# Altium schematic sheet ANALOG_OUTPUT.SchDoc: Analog output
size A4; Author: eldar6776@hotmail.com; DrawnBy: Eldar Dedic; Organization: PROVEN d.o.o.; Address1: Adema Buće 102; Address2: 71000 Sarajevo; Address3: Federacija BiH; Address4: Bosna i Hercegovina; DocumentNumber: CD-26514; Revision: 001; SheetNumber: 2; SheetTotal: 8; ProjectName: KONTROLER TRANSPORTA MATERIJALA
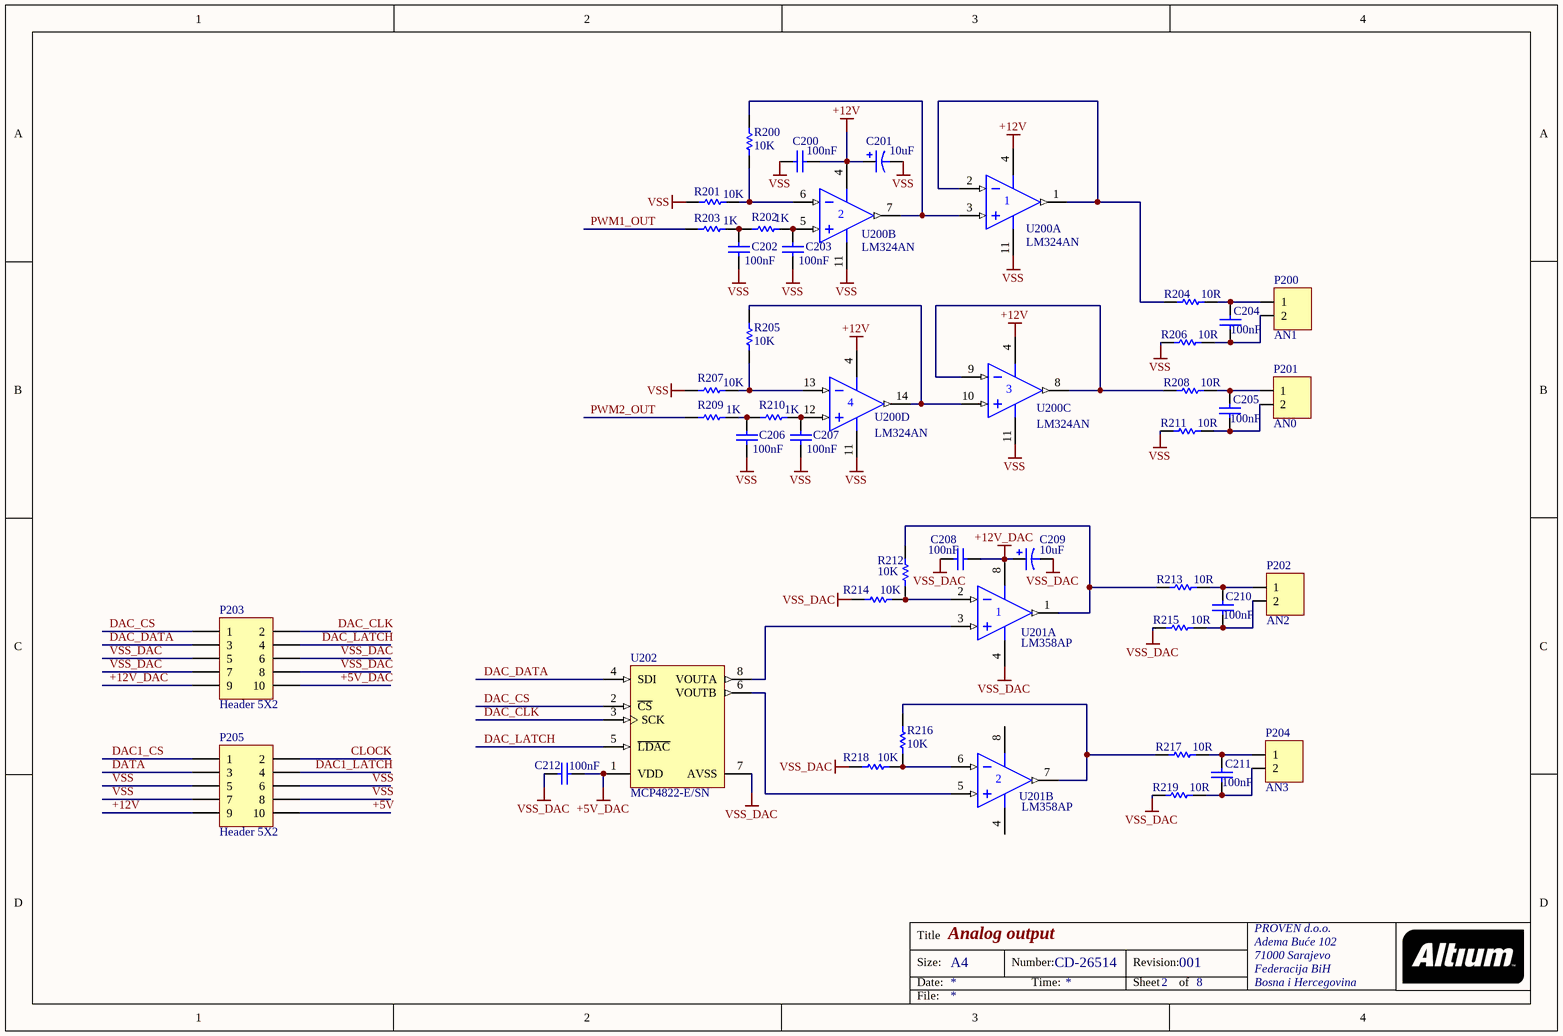
[diagram p0: ANALOG_OUTPUT.SchDoc]

## Parts
C200  value 100nF  [1206]
C201  10uF  [E]
C202  value 100nF  [1206]
C203  value 100nF  [1206]
C204  value 100nF  [1206]
C205  value 100nF  [1206]
C206  value 100nF  [1206]
C207  value 100nF  [1206]
C208  value 100nF  [1206]
C209  10uF  [CAPPR2.5-6.3X7]
C210  value 100nF  [1206]
C211  value 100nF  [1206]
C212  value 100nF  [1206]
P200  AN1  [TERMINAL BLOK 2]
P201  AN0  [TERMINAL BLOK 2]
P202  AN2  [TERMINAL BLOK 2]
P203  Header 5X2  [HDR2X5]
P204  AN3  [TERMINAL BLOK 2]
P205  Header 5X2  [HDR2X5]
R200  10K  [ERA-0805]
R201  10K  [ERA-0805]
R202  1K  [ERA-0805]
R203  1K  [ERA-0805]
R204  10R  [ERA-0805]
R205  10K  [ERA-0805]
R206  10R  [ERA-0805]
R207  10K  [ERA-0805]
R208  10R  [ERA-0805]
R209  1K  [ERA-0805]
R210  1K  [ERA-0805]
R211  10R  [ERA-0805]
R212  10K  [ERA-0805]
R213  10R  [ERA-0805]
R214  10K  [ERA-0805]
R215  10R  [ERA-0805]
R216  10K  [ERA-0805]
R217  10R  [ERA-0805]
R218  10K  [ERA-0805]
R219  10R  [ERA-0805]
U200  LM324AN  [N014]  (parts A,B,C,D of 4)
U201  LM358AP  [P008]  (parts A,B of 2)
U202  MCP4822-E/SN  [PDIP300-P8]

## Nets
+5V_DAC: C212.2 P203.10 U202.1(VDD)
+12V: C200.2 C201.1 P205.9 U200.4(V+)
+12V_DAC: C208.2 C209.1 P203.9 U201.8(V+)
VSS: C200.1 C201.2 C202.1 C203.1 C206.1 C207.1 P205.5 P205.6 P205.7 P205.8 R201.1 R206.1 R207.1 R211.1 U200.11(V-)
VSS_DAC: C208.1 C209.2 C212.1 P203.5 P203.6 P203.7 P203.8 R214.2 R215.1 R218.2 R219.1 U201.4(V-) U202.7(AVSS)
+5V: P205.10
CLOCK: P205.2
DAC1_CS: P205.1
DAC1_LATCH: P205.4
DAC_CLK: P203.2 U202.3(SCK)
DAC_CS: P203.1 U202.2(~{CS})
DAC_DATA: P203.3 U202.4(SDI)
DAC_LATCH: P203.4 U202.5(~{LDAC})
DATA: P205.3
PWM1_OUT: R203.1
PWM2_OUT: R209.1
NetC202_2: C202.2 R202.1 R203.2
NetC203_2: C203.2 R202.2 U200.5(IN+)
NetC204_1: C204.1 P200.2 R206.2
NetC204_2: C204.2 P200.1 R204.2
NetC205_1: C205.1 P201.2 R211.2
NetC205_2: C205.2 P201.1 R208.2
NetC206_2: C206.2 R209.2 R210.1
NetC207_2: C207.2 R210.2 U200.12(IN+)
NetC210_1: C210.1 P202.2 R215.2
NetC210_2: C210.2 P202.1 R213.2
NetC211_1: C211.1 P204.2 R219.2
NetC211_2: C211.2 P204.1 R217.2
NetR200_1: R200.1 R201.2 U200.6(IN-)
NetR200_2: R200.2 U200.3(IN+) U200.7(OUT)
NetR204_1: R204.1 U200.1(OUT) U200.2(IN-)
NetR205_1: R205.1 R207.2 U200.13(IN-)
NetR205_2: R205.2 U200.10(IN+) U200.14(OUT)
NetR208_1: R208.1 U200.8(OUT) U200.9(IN-)
NetR212_1: R212.1 R214.1 U201.2(IN-)
NetR212_2: R212.2 R213.1 U201.1(OUT)
NetR216_1: R216.1 R218.1 U201.6(IN-)
NetR216_2: R216.2 R217.1 U201.7(OUT)
NetU201_3: U201.3(IN+) U202.8(VOUTA)
NetU201_5: U201.5(IN+) U202.6(VOUTB)

## Notes on the sheet
- Title
- Size:
- Date:
- A4
- Number:
- Time:
- Revision:
- Sheet
- of
- File:

## Library data of the parts
C200 C202-C208 C210-C212 = C1206: Ceramic Chip Capacitor - Standard; Published: 17-Jul-2002; LatestRevisionDate: 19-Mar-2004; LatestRevisionNote: Silkscreen size reduced.; DatasheetDocument: Mar-2001; PackageDocument: Mar-2001; PackageReference: 1206; Publisher: Altium Limited; Code_JEITA: 1206; Code_IPC: 3216 [1206]; ComponentLink1Description: Manufacturer Link; ComponentLink1URL: http://www.kemet.com/; ComponentLink2Description: Datasheet; ComponentLink2URL: http://www.kemet.com/kemet/web/homepage/kechome.nsf/vapubfilesname/F3102TA.pdf/$file/F3102TA.pdf
C201 C209 = 94SA107X0010EBP: Solid Aluminum Capacitor with Organic Semiconductor Electrolyte: 100uF, 10V, Bulk Pack; Note: Part Numbers shown are for ± 20% capacitance tolerance (X0).; PCB_Layout: Complies with Manufacturer's Recommendation.; DrillSize: Nominal, Rounded to the nearest 0.1mm; Published: 19-Mar-2004; DatasheetDocument: 29-Jun-2001; PackageReference: E; Publisher: Altium Limited; ComponentLink1Description: Manufacturer Link; ComponentLink1URL: http://www.vishay.com/; ComponentLink2Description: Datasheet; ComponentLink2URL: http://www.vishay.com/docs/90003/94sa.pdf; Value: 100uF
P200-P202 P204 = Terminal blok 2 pina: Terminal blok 2
P203 P205 = Header 5X2: Header, 5-Pin, Dual row; LatestRevisionDate: 17-Jul-2002; LatestRevisionNote: Re-released for DXP Platform.; Publisher: Altium Limited
R200-R203 R205 R207 R209 R210 R212 R214 R216 R218 = ERAS: Metal Film Thermosensitive Chip Resistor, 0.56 Ohm to 10k Ohm Range, 5% Tolerance, 0805 Size, 0.1 W; Note: If flow soldering, adjust pad width of PCB Footprint to 0.7 - 0.8 times the width of the resistor.; Published: 17-Dec-2003; LatestRevisionDate: 19-Mar-2004; LatestRevisionNote: Silkscreen size reduced.; PackageDocument: Mar-2003; PackageReference: ERA-0805; Publisher: Altium Limited; Code_IPC: 2012 [0805]; ComponentLink1Description: Manufacturer Link; ComponentLink1URL: http://www.panasonic.com/industrial/components/resistive_products.htm; ComponentLink2Description: Datasheet; ComponentLink2URL: http://www.panasonic.com/industrial/components/pdf/AOF0000CE1.pdf
R204 R206 R208 R211 R213 R215 R217 R219 = ERA6Y: Rectangular Thick Film Chip Resistor, 10 Ohm to 1M Ohm Range, 0.1% and 0.5% Tolerance, 0805 Size, 0.1 W; Note: If flow soldering, adjust pad width of PCB Footprint to 0.7 - 0.8 times the width of the resistor.; Published: 17-Dec-2003; LatestRevisionDate: 19-Mar-2004; LatestRevisionNote: Silkscreen size reduced.; PackageDocument: Mar-2003; PackageReference: ERA-0805; Publisher: Altium Limited; Code_IPC: 2012 [0805]; ComponentLink1Description: Manufacturer Link; ComponentLink1URL: http://www.panasonic.com/industrial/components/resistive_products.htm; ComponentLink2Description: Datasheet; ComponentLink2URL: http://www.panasonic.com/industrial/components/pdf/AOA0000CE8.pdf
U200 = LM324AN: Quadruple Operational Amplifier; Published: 15-Apr-2002; LatestRevisionDate: 04-Mar-2005; LatestRevisionNote: Stylized 3D Model Added.; DatasheetVersion: Jan-1989; PackageVersion: Oct-1995; PackageReference: N014; Publisher: Altium Limited; PackageDescription: DIP; 14 Leads; Row Spacing 7.62 mm; Pitch 2.54 mm; ComponentLink1Description: Manufacturer Link; ComponentLink1URL: http://www.ti.com/; ComponentLink2Description: Datasheet; ComponentLink2URL: http://www-s.ti.com/sc/ds/lm324.pdf
U201 = LM358AP: Dual Operational Amplifier; Published: 15-Apr-2002; LatestRevisionDate: 04-Mar-2005; LatestRevisionNote: Stylized 3D Model Added.; DatasheetVersion: Aug-1988; PackageVersion: Jun-1999; PackageReference: P008; Publisher: Altium Limited; PackageDescription: DIP; 8 Leads; Row Spacing 7.62 mm; Pitch 2.54 mm; Code_JEDEC: MO-001-AN; ComponentLink1Description: Manufacturer Link; ComponentLink1URL: http://www.ti.com/; ComponentLink2Description: Datasheet; ComponentLink2URL: http://www-s.ti.com/sc/ds/lm358.pdf
U202 = MCP4822-E/SN: 12-Bit DACs with Internal VREF and SPI Interface, 8-Pin SOIC 150mil, Extended Temperature; Published: 29-Jan-2009; DatasheetVersion: revA, Jun-2005; PackageVersion: revBB, Aug-2009; PackageReference: SOIC-SN8; Publisher: Altium Limited; PackageDescription: 8-Lead Plastic Small Outline (SN) - Narrow, 3.90mm Body [SOIC]; Supplier 1: Digi-Key; Supplier Part Number 1: MCP4822-E/SN-ND; Supplier 2: Farnell; Supplier Part Number 2: 1439414; Code_JEDEC: MS-012; Code_IPC: SOIC127P600-8; ComponentLink1Description: Datasheet; ComponentLink1URL: http://ww1.microchip.com/downloads/en/DeviceDoc/21953a.pdf; ComponentLink2Description: Packaging Specification; ComponentLink2URL: http://www.microchip.com/stellent/groups/techpub_sg/documents/packagingspec/en012702.pdf; ComponentLink3Description: Microchip.com Home; ComponentLink3URL: http://www.microchip.com/